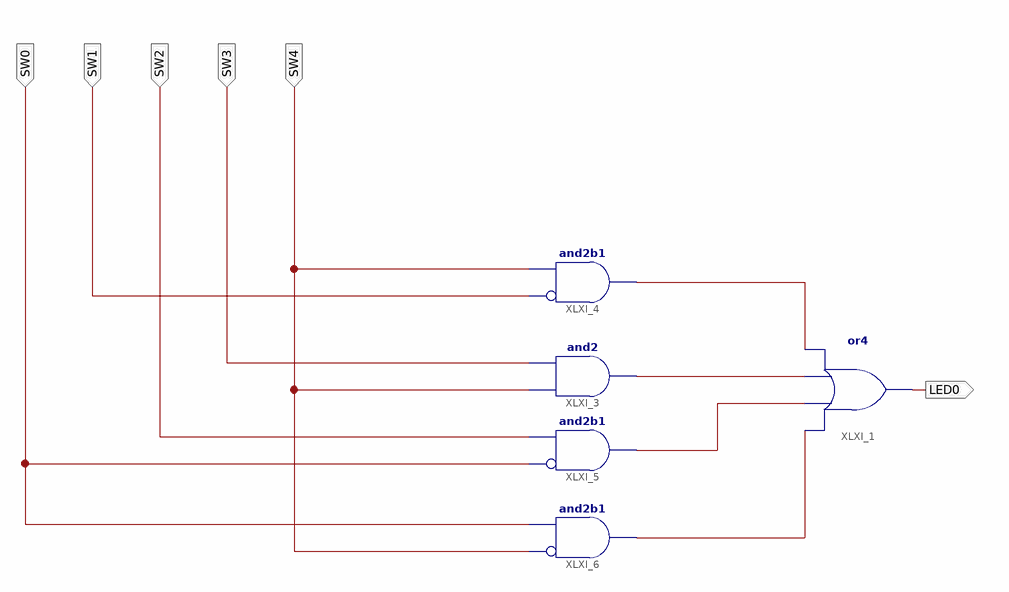
[diagram p0: schematic sheet 1]
// Xilinx ISE schematic main.sch (spartan6) as structural Verilog: 5 symbols, 6 ports
module main (
  input  SW0,
  input  SW1,
  input  SW2,
  input  SW3,
  input  SW4,
  output LED0
);

  wire XLXN_13, XLXN_14, XLXN_15, XLXN_16;

  or XLXI_1 (LED0, XLXN_16, XLXN_15, XLXN_14, XLXN_13);
  and XLXI_3 (XLXN_14, SW4, SW3);
  and XLXI_4 (XLXN_13, ~SW1, SW4);  // and2b1
  and XLXI_5 (XLXN_15, ~SW0, SW2);  // and2b1
  and XLXI_6 (XLXN_16, ~SW4, SW0);  // and2b1
endmodule
